# Altium schematic sheet [2] - Power Budget.SchDoc: Power budget
size A4; Project Code: A_V1.3; Date: 2025-08-28; ApprovedBy: M Pourmand; CheckedBy: M Pourmand; Author: M Pourmand; CompanyName: Freelance; DrawnBy: M Pourmand; Engineer: M Pourmand; Organization: Freelance; Address1: Paradisgränd 03; Address2: Umedalen; Address3: Umeå; Address4: Sweden; DocumentNumber: 0101020251118001; SheetNumber: 1; SheetTotal: 11; ItemRevision: 1; Time: 17:40
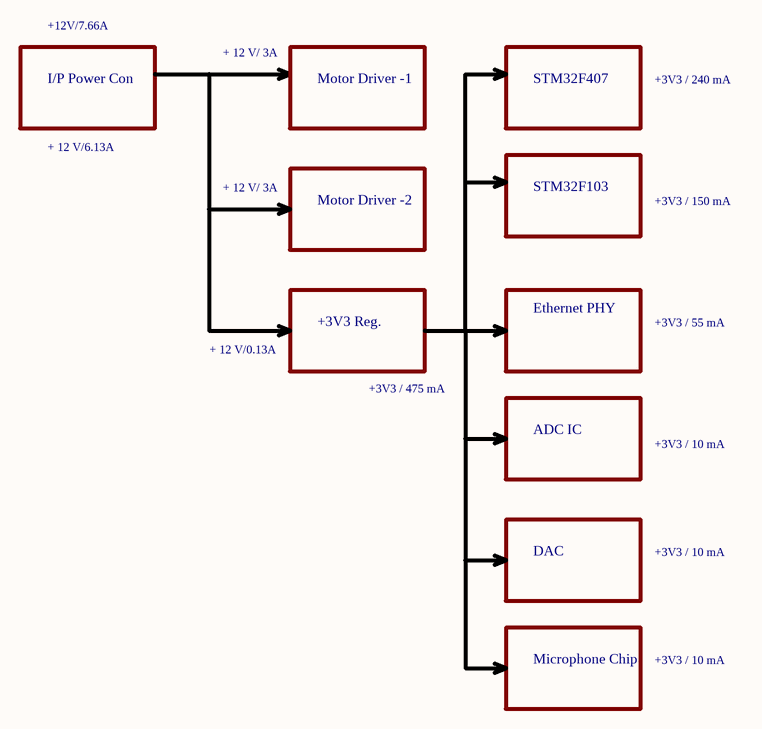
[diagram p0: [2] - Power Budget.SchDoc]

## Notes on the sheet
- +12V/7.66A
- I/P Power Con
- + 12 V/ 3A
- Motor Driver -1
- STM32F407
- +3V3 / 240 mA
- + 12 V/6.13A
- Motor Driver -2
- STM32F103
- +3V3 / 150 mA
- + 12 V/0.13A
- +3V3 Reg.
- Ethernet PHY
- +3V3 / 55 mA
- +3V3 / 475 mA
- ADC IC
- +3V3 / 10 mA
- DAC
- Microphone Chip
- ENG:
- APPROVALS
- DATE
- PROJECT
- DSN:
- CHK:
- REFERENCE DOCUMENTS
- PROJECT REVISION:
- TITLE
- DOCUMENT REVISION:
- DESIGN ITEM:
- BOM:
- FAB DWG:
- PCB DWG:
- ASSY DWG:
- FILE NAME
- A4
- SIZE
- DWG NO.
- SHEET
- OF
- REV